# Altium schematic sheet [06] - FPGA CONFIG, TEMP MON.SchDoc
size A4; DocumentNumber: 6; SheetNumber: 6; SheetTotal: 15
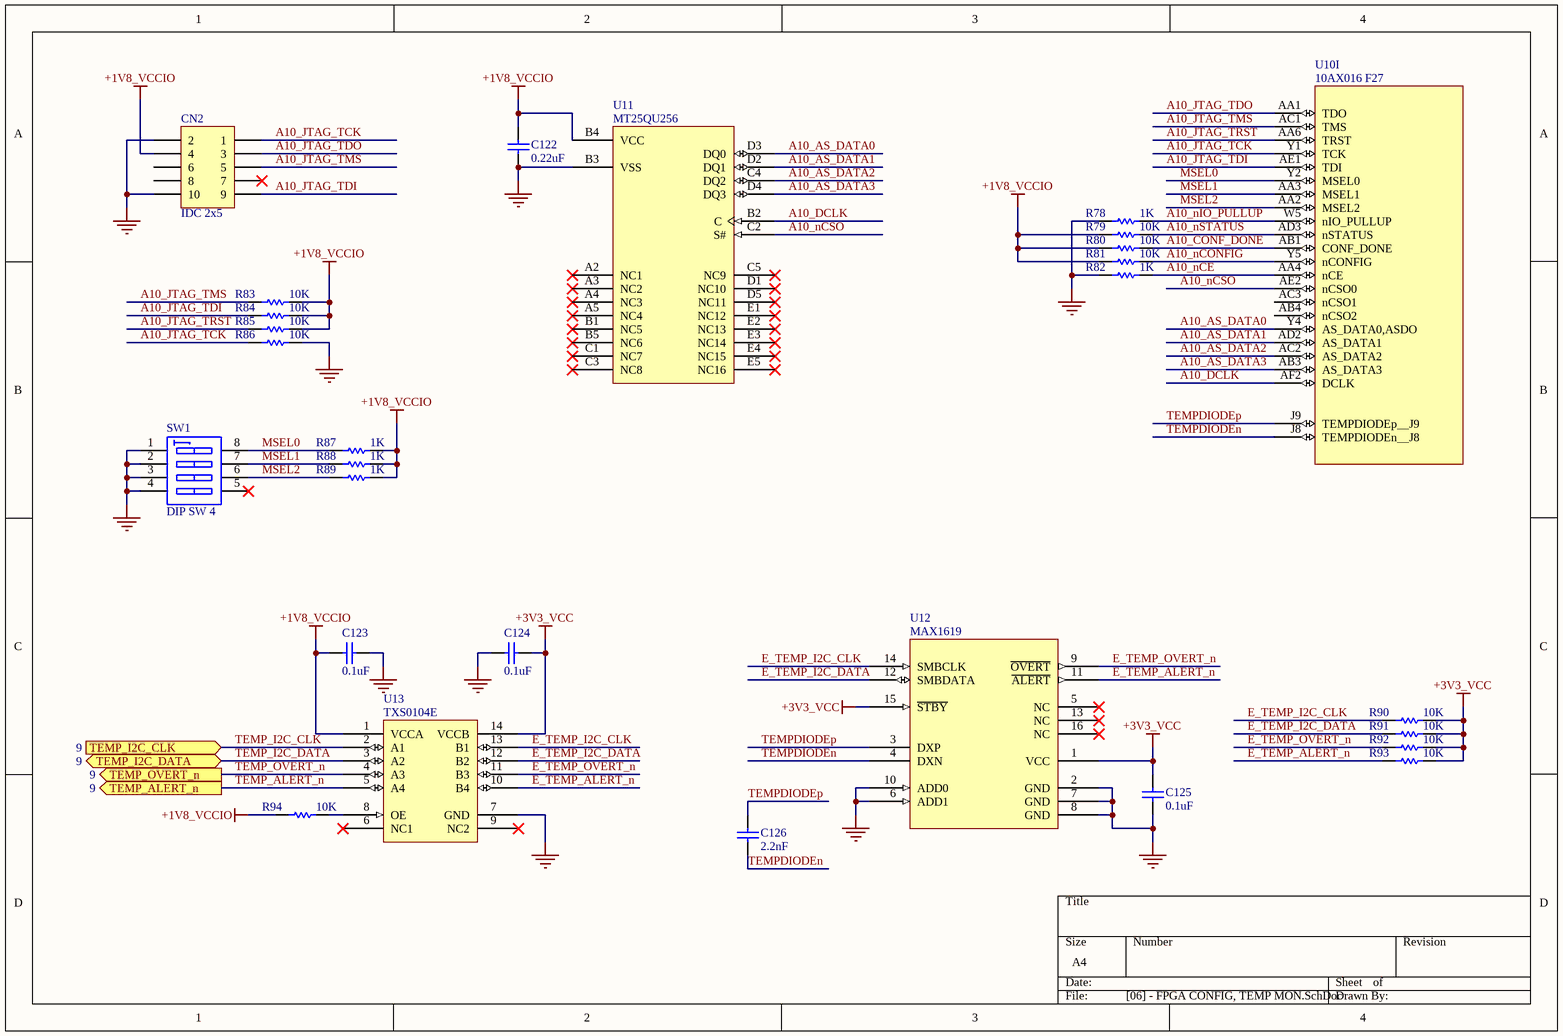
[diagram p0: [06] - FPGA CONFIG, TEMP MON.SchDoc]

## Parts
C122  0.22uF  [0402_C]
C123  0.1uF  [0805_C]
C124  0.1uF  [0805_C]
C125  0.1uF  [0805_C]
C126  2.2nF  [0805_C]
CN2  IDC 2x5  [IDC-BOX-2x5]
R78  1K  [0402_R]
R79  10K  [0402_R]
R80  10K  [0402_R]
R81  10K  [0402_R]
R82  1K  [0402_R]
R83  10K  [0402_R]
R84  10K  [0402_R]
R85  10K  [0402_R]
R86  10K  [0402_R]
R87  1K  [0402_R]
R88  1K  [0402_R]
R89  1K  [0402_R]
R90  10K  [0402_R]
R91  10K  [0402_R]
R92  10K  [0402_R]
R93  10K  [0402_R]
R94  10K  [0402_R]
SW1  DIP SW 4  [DIP-SW-4_1.27mm]
U10  10AX016 F27  [FBGA672]  (part I of 12)
U11  MT25QU256
U12  MAX1619
U13  TXS0104E

## Ports
TEMP_ALERT_n (out, see 9), TEMP_I2C_CLK (in, see 9), TEMP_I2C_DATA (bidir, see 9), TEMP_OVERT_n (out, see 9)

## Nets
+1V8_VCCIO: C122.2 C123.2 CN2.4 R79.1 R80.1 R81.1 R83.2 R84.2 R85.2 R87.2 R88.2 R89.2 R94.1 U11.B4(VCC) U13.1(VCCA)
+3V3_VCC: C124.1 C125.2 R90.2 R91.2 R92.2 R93.2 U12.1(VCC) U12.15(~{STBY}) U13.14(VCCB)
GND: C122.1 C123.1 C124.2 C125.1 CN2.2 CN2.10 R78.1 R82.1 R86.2 SW1.1(A1) SW1.2(A2) SW1.3(A3) SW1.4(A4) U11.B3(VSS) U12.2(GND) U12.6(ADD1) U12.7(GND) U12.8(GND) U12.10(ADD0) U13.7(GND)
A10_AS_DATA0: U10.Y4(AS_DATA0,ASDO) U11.D3(DQ0)
A10_AS_DATA1: U10.AD2(AS_DATA1) U11.D2(DQ1)
A10_AS_DATA2: U10.AC2(AS_DATA2) U11.C4(DQ2)
A10_AS_DATA3: U10.AB3(AS_DATA3) U11.D4(DQ3)
A10_CONF_DONE: R80.2 U10.AB1(CONF_DONE)
A10_DCLK: U10.AF2(DCLK) U11.B2(C)
A10_JTAG_TCK: CN2.1 R86.1 U10.Y1(TCK)
A10_JTAG_TDI: CN2.9 R84.1 U10.AE1(TDI)
A10_JTAG_TDO: CN2.3 U10.AA1(TDO)
A10_JTAG_TMS: CN2.5 R83.1 U10.AC1(TMS)
A10_JTAG_TRST: R85.1 U10.AA6(TRST)
A10_nCE: R82.2 U10.AA4(nCE)
A10_nCONFIG: R81.2 U10.Y5(nCONFIG)
A10_nCSO: U10.AE2(nCSO0) U11.C2(S#)
A10_nIO_PULLUP: R78.2 U10.W5(nIO_PULLUP)
A10_nSTATUS: R79.2 U10.AD3(nSTATUS)
E_TEMP_ALERT_n: R93.1 U12.11(~{ALERT}) U13.10(B4)
E_TEMP_I2C_CLK: R90.1 U12.14(SMBCLK) U13.13(B1)
E_TEMP_I2C_DATA: R91.1 U12.12(SMBDATA) U13.12(B2)
E_TEMP_OVERT_n: R92.1 U12.9(~{OVERT}) U13.11(B3)
MSEL0: R87.1 SW1.8(B3) U10.Y2(MSEL0)
MSEL1: R88.1 SW1.7(B4) U10.AA3(MSEL1)
MSEL2: R89.1 SW1.6(B5) U10.AA2(MSEL2)
TEMP_ALERT_n: U13.5(A4) ; port TEMP_ALERT_n
TEMP_I2C_CLK: U13.2(A1) ; port TEMP_I2C_CLK
TEMP_I2C_DATA: U13.3(A2) ; port TEMP_I2C_DATA
TEMP_OVERT_n: U13.4(A3) ; port TEMP_OVERT_n
TEMPDIODEn: C126.1 U10.J8(TEMPDIODEn__J8) U12.4(DXN)
TEMPDIODEp: C126.2 U10.J9(TEMPDIODEp__J9) U12.3(DXP)
NetR94_2: R94.2 U13.8(OE)

Not connected (* = marked no-connect by the designer): CN2 6 7* 8; SW1 5(A5)*; U10 AB4(nCSO2) AC3(nCSO1); U11 A2(NC1)* A3(NC2)* A4(NC3)* A5(NC4)* B1(NC5)* B5(NC6)* C1(NC7)* C3(NC8)* C5(NC9)* D1(NC10)* D5(NC11)* E1(NC12)* E2(NC13)* E3(NC14)* E4(NC15)* E5(NC16)*; U12 5(NC)* 13(NC)* 16(NC)*; U13 6(NC1)* 9(NC2)*

## Library data of the parts
C122-C126 = Cap SMD: Non-Pol SMD Capacitor; RATED_VOLTAGE: 25V; Manufacturer Part Num: *; Dielectric: *
  C122: Value: 0.22uF
  C123-C125: Value: 0.1uF
  C126: Value: 2.2nF
CN2 = IDC 2x5: IDC Box, 5-Pin, Dual row; Value: IDC 2x5
R78-R94 = Res SMD: SMD Resistor; Tolerance: 5%; Manufacturer Part Num: *
  R78 R82 R87-R89: Value: 1K
  R79-R81 R83-R86 R90-R94: Value: 10K
SW1 = DIP SW-4: DIP Switch, 4 Position, SPST; Manufacturer Part Num: GDH04S04; Value: DIP SW 4
U10 = 10AX016: Value: 10AX016 F27; Manufacturer Part Num: *
U11 = MT25QU: Micron Serial NOR Flash Memory; Manufacturer Part Num: MT25QU256ABA8E12-1SIT; Value: MT25QU256
U12 = MAX1619: Remote/Local Temperature Sensor; Value: MAX1619; Manufacturer Part Num: *
U13 = TXS0104E: 4-Bit Bidirectional Voltage-Level Translator for Open-Drain and Push-Pull Applications; Value: TXS0104E; Manufacturer Part Num: *